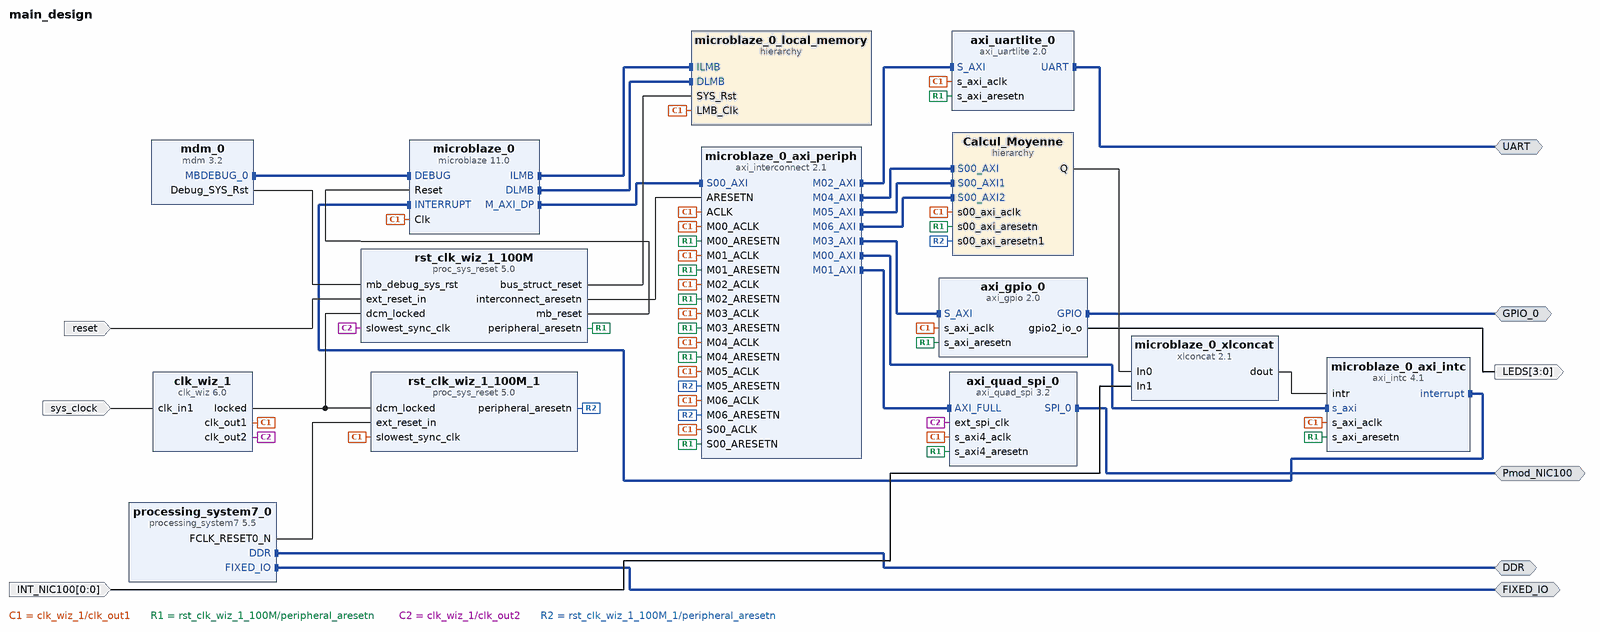
[diagram p0: block diagram of the top level]
# Vivado block design main_design, xc7z010clg400-1, Vivado 2020.2
create_bd_design main_design

create_bd_intf_port -mode Master -vlnv xilinx.com:interface:spi_rtl:1.0 Pmod_NIC100
create_bd_intf_port -mode Master -vlnv xilinx.com:interface:uart_rtl:1.0 UART
create_bd_intf_port -mode Master -vlnv xilinx.com:interface:gpio_rtl:1.0 GPIO_0
create_bd_intf_port -mode Master -vlnv xilinx.com:interface:ddrx_rtl:1.0 DDR
create_bd_intf_port -mode Master -vlnv xilinx.com:display_processing_system7:fixedio_rtl:1.0 FIXED_IO
create_bd_port -dir I -type rst reset
set_property -dict {CONFIG.POLARITY ACTIVE_HIGH} [get_bd_ports reset]
create_bd_port -dir I -type clk sys_clock
set_property -dict {CONFIG.FREQ_HZ 125000000} [get_bd_ports sys_clock]
create_bd_port -dir I -from 0 -to 0 INT_NIC100
create_bd_port -dir O -from 3 -to 0 LEDS

create_bd_cell -type ip -vlnv xilinx.com:ip:microblaze:11.0 microblaze_0
set_property -dict [list \
  CONFIG.C_ADDR_TAG_BITS 0 \
  CONFIG.C_DCACHE_ADDR_TAG 0 \
  CONFIG.C_DEBUG_ENABLED 1 \
  CONFIG.C_D_AXI 1 \
  CONFIG.C_D_LMB 1 \
  CONFIG.C_I_LMB 1 \
  CONFIG.C_NUMBER_OF_PC_BRK 4 \
  CONFIG.C_USE_BRANCH_TARGET_CACHE 1 \
  CONFIG.C_USE_DIV 1 \
  CONFIG.C_USE_FPU 2 \
  CONFIG.C_USE_HW_MUL 1 \
  CONFIG.C_USE_STACK_PROTECTION 1 \
] [get_bd_cells microblaze_0]
create_bd_cell -type ip -vlnv xilinx.com:ip:mdm:3.2 mdm_0
create_bd_cell -type hier microblaze_0_local_memory
create_bd_cell -type ip -vlnv xilinx.com:ip:axi_interconnect:2.1 microblaze_0_axi_periph
set_property -dict {CONFIG.NUM_MI 7} [get_bd_cells microblaze_0_axi_periph]
create_bd_cell -type ip -vlnv xilinx.com:ip:axi_intc:4.1 microblaze_0_axi_intc
set_property -dict [list \
  CONFIG.C_HAS_FAST 0 \
  CONFIG.C_KIND_OF_INTR 0xFFFFFFFD \
  CONFIG.C_KIND_OF_LVL 0xFFFFFFFD \
] [get_bd_cells microblaze_0_axi_intc]
create_bd_cell -type ip -vlnv xilinx.com:ip:xlconcat:2.1 microblaze_0_xlconcat
create_bd_cell -type hier Calcul_Moyenne
create_bd_cell -type ip -vlnv xilinx.com:ip:axi_gpio:2.0 axi_gpio_0
set_property -dict [list \
  CONFIG.C_ALL_INPUTS 0 \
  CONFIG.C_ALL_INPUTS_2 0 \
  CONFIG.C_GPIO2_WIDTH 4 \
  CONFIG.C_GPIO_WIDTH 4 \
  CONFIG.C_IS_DUAL 1 \
  CONFIG.GPIO2_BOARD_INTERFACE Custom \
  CONFIG.GPIO_BOARD_INTERFACE Custom \
  CONFIG.USE_BOARD_FLOW true \
] [get_bd_cells axi_gpio_0]
create_bd_cell -type ip -vlnv xilinx.com:ip:processing_system7:5.5 processing_system7_0
set_property -dict [list \
  CONFIG.PCW_APU_PERIPHERAL_FREQMHZ 667 \
  CONFIG.PCW_ENET0_ENET0_IO {MIO 16 .. 27} \
  CONFIG.PCW_ENET0_GRP_MDIO_ENABLE 1 \
  CONFIG.PCW_ENET0_GRP_MDIO_IO {MIO 52 .. 53} \
  CONFIG.PCW_ENET0_PERIPHERAL_ENABLE 1 \
  CONFIG.PCW_ENET0_RESET_ENABLE 0 \
  CONFIG.PCW_ENET_RESET_ENABLE 1 \
  CONFIG.PCW_ENET_RESET_SELECT {Share reset pin} \
  CONFIG.PCW_FPGA0_PERIPHERAL_FREQMHZ 50 \
  CONFIG.PCW_FPGA1_PERIPHERAL_FREQMHZ 50 \
  CONFIG.PCW_GPIO_MIO_GPIO_ENABLE 1 \
  CONFIG.PCW_GPIO_MIO_GPIO_IO MIO \
  CONFIG.PCW_I2C_RESET_ENABLE 1 \
  CONFIG.PCW_PERIPHERAL_BOARD_PRESET part0 \
  CONFIG.PCW_PRESET_BANK1_VOLTAGE {LVCMOS 1.8V} \
  CONFIG.PCW_QSPI_GRP_FBCLK_ENABLE 1 \
  CONFIG.PCW_QSPI_GRP_FBCLK_IO {MIO 8} \
  CONFIG.PCW_QSPI_GRP_SINGLE_SS_ENABLE 1 \
  CONFIG.PCW_QSPI_GRP_SINGLE_SS_IO {MIO 1 .. 6} \
  CONFIG.PCW_QSPI_PERIPHERAL_ENABLE 1 \
  CONFIG.PCW_QSPI_QSPI_IO {MIO 1 .. 6} \
  CONFIG.PCW_SD0_GRP_CD_ENABLE 1 \
  CONFIG.PCW_SD0_GRP_CD_IO {MIO 47} \
  CONFIG.PCW_SD0_GRP_WP_ENABLE 0 \
  CONFIG.PCW_SD0_PERIPHERAL_ENABLE 1 \
  CONFIG.PCW_SD0_SD0_IO {MIO 40 .. 45} \
  CONFIG.PCW_SDIO_PERIPHERAL_FREQMHZ 50 \
  CONFIG.PCW_SINGLE_QSPI_DATA_MODE x4 \
  CONFIG.PCW_UART1_PERIPHERAL_ENABLE 1 \
  CONFIG.PCW_UART1_UART1_IO {MIO 48 .. 49} \
  CONFIG.PCW_UART_PERIPHERAL_FREQMHZ 100 \
  CONFIG.PCW_UIPARAM_DDR_FREQ_MHZ 533.333333 \
  CONFIG.PCW_UIPARAM_DDR_MEMORY_TYPE {DDR 3 (Low Voltage)} \
  CONFIG.PCW_UIPARAM_DDR_PARTNO {MT41K256M16 RE-125} \
  CONFIG.PCW_USB0_PERIPHERAL_ENABLE 1 \
  CONFIG.PCW_USB0_RESET_ENABLE 1 \
  CONFIG.PCW_USB0_RESET_IO {MIO 46} \
  CONFIG.PCW_USB0_USB0_IO {MIO 28 .. 39} \
  CONFIG.PCW_USB_RESET_ENABLE 1 \
  CONFIG.PCW_USB_RESET_SELECT {Share reset pin} \
  CONFIG.PCW_USE_M_AXI_GP0 0 \
] [get_bd_cells processing_system7_0]
# 493 more settings of processing_system7_0 are not shown: defaults, MIO pin electricals, DDR timing, and values the tool derives
create_bd_cell -type ip -vlnv xilinx.com:ip:proc_sys_reset:5.0 rst_clk_wiz_1_100M
create_bd_cell -type ip -vlnv xilinx.com:ip:clk_wiz:6.0 clk_wiz_1
set_property -dict [list \
  CONFIG.CLKIN1_JITTER_PS 80.0 \
  CONFIG.CLKOUT1_JITTER 124.615 \
  CONFIG.CLKOUT1_PHASE_ERROR 96.948 \
  CONFIG.CLKOUT2_JITTER 172.798 \
  CONFIG.CLKOUT2_PHASE_ERROR 96.948 \
  CONFIG.CLKOUT2_REQUESTED_OUT_FREQ 20 \
  CONFIG.CLKOUT2_USED true \
  CONFIG.CLK_IN1_BOARD_INTERFACE Custom \
  CONFIG.MMCM_CLKFBOUT_MULT_F 8.000 \
  CONFIG.MMCM_CLKIN1_PERIOD 8.000 \
  CONFIG.MMCM_CLKOUT1_DIVIDE 50 \
  CONFIG.NUM_OUT_CLKS 2 \
  CONFIG.PRIM_IN_FREQ 125.000 \
  CONFIG.PRIM_SOURCE Single_ended_clock_capable_pin \
  CONFIG.USE_RESET false \
] [get_bd_cells clk_wiz_1]
create_bd_cell -type ip -vlnv xilinx.com:ip:axi_uartlite:2.0 axi_uartlite_0
set_property -dict {CONFIG.C_BAUDRATE 115200} [get_bd_cells axi_uartlite_0]
create_bd_cell -type ip -vlnv xilinx.com:ip:axi_quad_spi:3.2 axi_quad_spi_0
set_property -dict [list \
  CONFIG.C_FIFO_DEPTH 0 \
  CONFIG.C_SCK_RATIO 2 \
  CONFIG.C_TYPE_OF_AXI4_INTERFACE 1 \
  CONFIG.C_USE_STARTUP 0 \
  CONFIG.FIFO_INCLUDED 0 \
] [get_bd_cells axi_quad_spi_0]
create_bd_cell -type ip -vlnv xilinx.com:ip:proc_sys_reset:5.0 rst_clk_wiz_1_100M_1

# ---- hierarchy /microblaze_0_local_memory ----
current_bd_instance /microblaze_0_local_memory
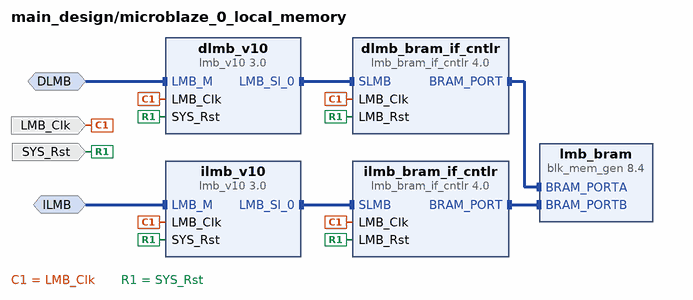
[diagram p1: block diagram inside /microblaze_0_local_memory]
create_bd_intf_pin -mode MirroredMaster -vlnv xilinx.com:interface:lmb_rtl:1.0 DLMB
create_bd_intf_pin -mode MirroredMaster -vlnv xilinx.com:interface:lmb_rtl:1.0 ILMB
create_bd_pin -dir I -type clk LMB_Clk
create_bd_pin -dir I -type rst SYS_Rst

create_bd_cell -type ip -vlnv xilinx.com:ip:lmb_v10:3.0 dlmb_v10
create_bd_cell -type ip -vlnv xilinx.com:ip:lmb_v10:3.0 ilmb_v10
create_bd_cell -type ip -vlnv xilinx.com:ip:lmb_bram_if_cntlr:4.0 dlmb_bram_if_cntlr
set_property -dict {CONFIG.C_ECC 0} [get_bd_cells dlmb_bram_if_cntlr]
create_bd_cell -type ip -vlnv xilinx.com:ip:lmb_bram_if_cntlr:4.0 ilmb_bram_if_cntlr
set_property -dict {CONFIG.C_ECC 0} [get_bd_cells ilmb_bram_if_cntlr]
create_bd_cell -type ip -vlnv xilinx.com:ip:blk_mem_gen:8.4 lmb_bram
set_property -dict {CONFIG.Memory_Type True_Dual_Port_RAM CONFIG.use_bram_block BRAM_Controller} [get_bd_cells lmb_bram]

# ---- hierarchy /Calcul_Moyenne ----
current_bd_instance /Calcul_Moyenne
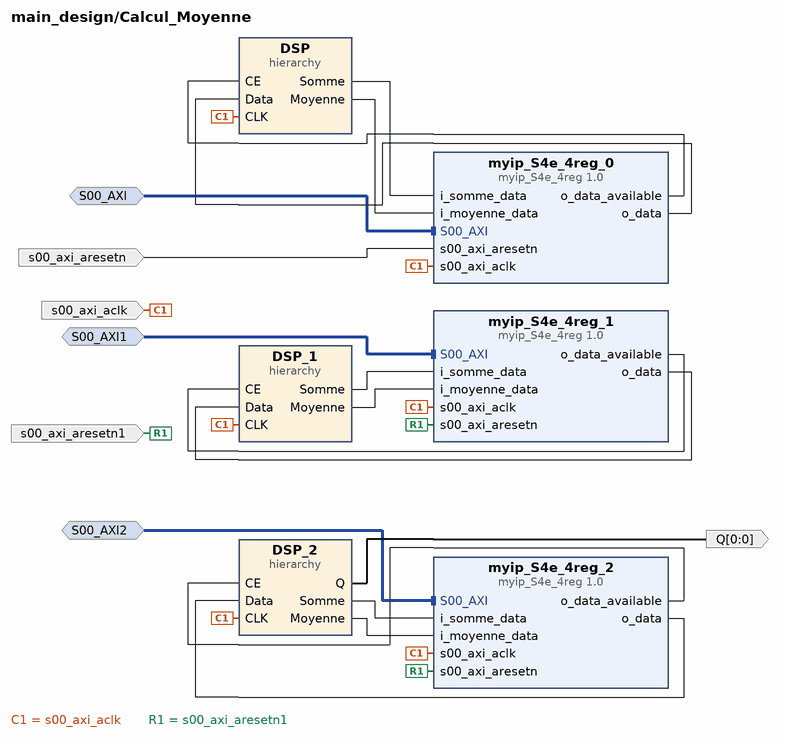
[diagram p2: block diagram inside /Calcul_Moyenne]
create_bd_intf_pin -mode Slave -vlnv xilinx.com:interface:aximm_rtl:1.0 S00_AXI
create_bd_intf_pin -mode Slave -vlnv xilinx.com:interface:aximm_rtl:1.0 S00_AXI1
create_bd_intf_pin -mode Slave -vlnv xilinx.com:interface:aximm_rtl:1.0 S00_AXI2
create_bd_pin -dir I -type clk s00_axi_aclk
create_bd_pin -dir I -type rst s00_axi_aresetn
create_bd_pin -dir O -from 0 -to 0 -type data Q
create_bd_pin -dir I -type rst s00_axi_aresetn1

create_bd_cell -type hier DSP_1
create_bd_cell -type ip -vlnv S4e:user:myip_S4e_4reg:1.0 myip_S4e_4reg_0
create_bd_cell -type ip -vlnv S4e:user:myip_S4e_4reg:1.0 myip_S4e_4reg_1
create_bd_cell -type ip -vlnv S4e:user:myip_S4e_4reg:1.0 myip_S4e_4reg_2
create_bd_cell -type hier DSP_2
create_bd_cell -type hier DSP

# ---- hierarchy /Calcul_Moyenne/DSP_1 ----
current_bd_instance /Calcul_Moyenne/DSP_1
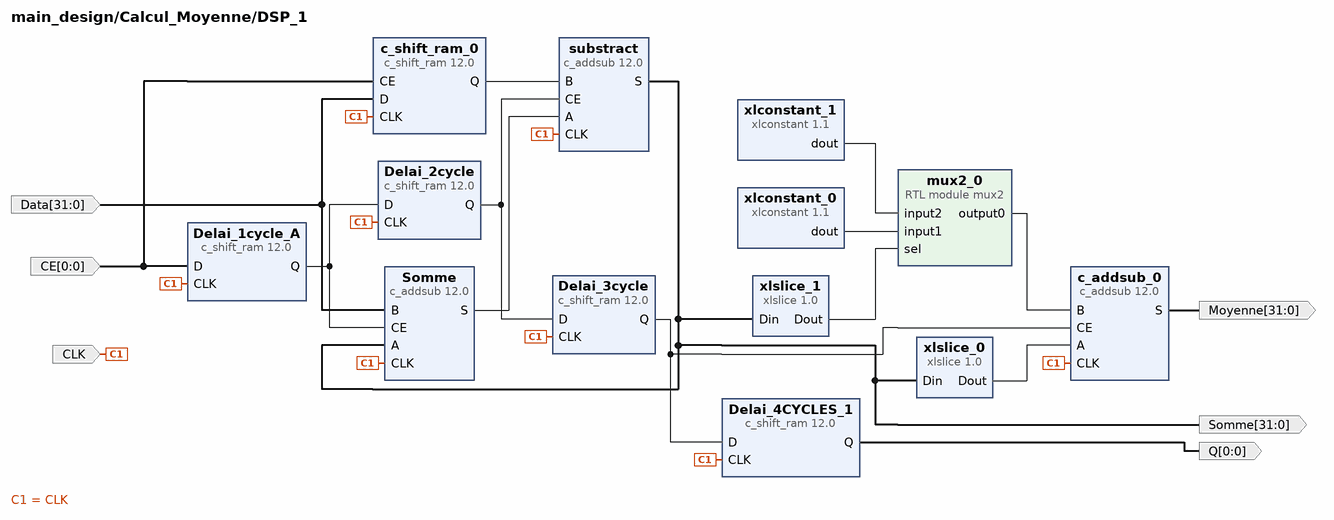
[diagram p3: block diagram inside /Calcul_Moyenne/DSP_1]
create_bd_pin -dir I -from 31 -to 0 Data
create_bd_pin -dir I -type clk CLK
create_bd_pin -dir I -from 0 -to 0 -type data CE
create_bd_pin -dir O -from 31 -to 0 -type data Somme
create_bd_pin -dir O -from 31 -to 0 Moyenne
create_bd_pin -dir O -from 0 -to 0 -type data Q

create_bd_cell -type ip -vlnv xilinx.com:ip:c_shift_ram:12.0 Delai_1cycle_A
set_property -dict {CONFIG.AsyncInitVal 0 CONFIG.DefaultData 0 CONFIG.Depth 1 CONFIG.Width 1} [get_bd_cells Delai_1cycle_A]
create_bd_cell -type ip -vlnv xilinx.com:ip:c_addsub:12.0 Somme
set_property -dict [list \
  CONFIG.A_Type Signed \
  CONFIG.A_Width 32 \
  CONFIG.Add_Mode Add \
  CONFIG.B_Type Signed \
  CONFIG.B_Value 00000000000000000000000000000000 \
  CONFIG.B_Width 32 \
  CONFIG.Latency 1 \
  CONFIG.Out_Width 32 \
] [get_bd_cells Somme]
create_bd_cell -type ip -vlnv xilinx.com:ip:c_shift_ram:12.0 c_shift_ram_0
set_property -dict [list \
  CONFIG.AsyncInitVal 00000000000000000000000000000000 \
  CONFIG.CE true \
  CONFIG.DefaultData 00000000000000000000000000000000 \
  CONFIG.Depth 9 \
  CONFIG.ReadMifFile false \
  CONFIG.SCLR false \
  CONFIG.ShiftRegType Fixed_Length \
  CONFIG.Width 32 \
] [get_bd_cells c_shift_ram_0]
create_bd_cell -type ip -vlnv xilinx.com:ip:c_addsub:12.0 substract
set_property -dict [list \
  CONFIG.A_Type Signed \
  CONFIG.A_Width 32 \
  CONFIG.Add_Mode Subtract \
  CONFIG.B_Type Signed \
  CONFIG.B_Value 00000000000000000000000000000000 \
  CONFIG.B_Width 32 \
  CONFIG.Implementation Fabric \
  CONFIG.Latency 1 \
  CONFIG.Latency_Configuration Manual \
  CONFIG.Out_Width 32 \
] [get_bd_cells substract]
create_bd_cell -type ip -vlnv xilinx.com:ip:c_shift_ram:12.0 Delai_3cycle
set_property -dict {CONFIG.AsyncInitVal 0 CONFIG.DefaultData 0 CONFIG.Depth 1 CONFIG.Width 1} [get_bd_cells Delai_3cycle]
create_bd_cell -type ip -vlnv xilinx.com:ip:xlslice:1.0 xlslice_0
set_property -dict {CONFIG.DIN_FROM 31 CONFIG.DIN_TO 3 CONFIG.DOUT_WIDTH 29} [get_bd_cells xlslice_0]
create_bd_cell -type ip -vlnv xilinx.com:ip:c_shift_ram:12.0 Delai_2cycle
set_property -dict {CONFIG.AsyncInitVal 0 CONFIG.DefaultData 0 CONFIG.Depth 2 CONFIG.Width 1} [get_bd_cells Delai_2cycle]
create_bd_cell -type ip -vlnv xilinx.com:ip:c_addsub:12.0 c_addsub_0
set_property -dict [list \
  CONFIG.A_Type Signed \
  CONFIG.A_Width 32 \
  CONFIG.B_Constant false \
  CONFIG.B_Type Signed \
  CONFIG.B_Value 00000000000000000000000000000000 \
  CONFIG.B_Width 32 \
  CONFIG.Latency 1 \
  CONFIG.Out_Width 32 \
] [get_bd_cells c_addsub_0]
create_bd_cell -type ip -vlnv xilinx.com:ip:c_shift_ram:12.0 Delai_4CYCLES_1
set_property -dict {CONFIG.AsyncInitVal 0 CONFIG.DefaultData 0 CONFIG.Depth 1 CONFIG.Width 1} [get_bd_cells Delai_4CYCLES_1]
create_bd_cell -type ip -vlnv xilinx.com:ip:xlslice:1.0 xlslice_1
set_property -dict {CONFIG.DIN_FROM 31 CONFIG.DIN_TO 31 CONFIG.DOUT_WIDTH 1} [get_bd_cells xlslice_1]
create_bd_cell -type ip -vlnv xilinx.com:ip:xlconstant:1.1 xlconstant_0
set_property -dict {CONFIG.CONST_VAL 0 CONFIG.CONST_WIDTH 32} [get_bd_cells xlconstant_0]
create_bd_cell -type ip -vlnv xilinx.com:ip:xlconstant:1.1 xlconstant_1
set_property -dict {CONFIG.CONST_VAL 0xE0000000 CONFIG.CONST_WIDTH 32} [get_bd_cells xlconstant_1]
create_bd_cell -type module -reference mux2 mux2_0

# ---- hierarchy /Calcul_Moyenne/DSP_2 ----
current_bd_instance /Calcul_Moyenne/DSP_2
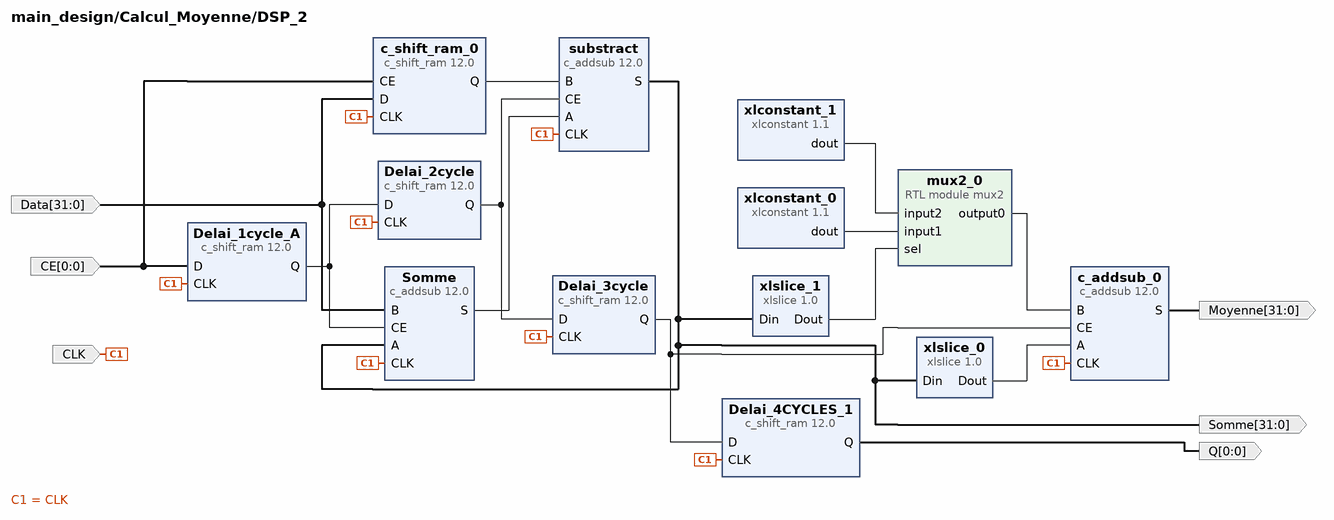
[diagram p4: block diagram inside /Calcul_Moyenne/DSP_2]
create_bd_pin -dir I -from 31 -to 0 Data
create_bd_pin -dir I -type clk CLK
create_bd_pin -dir I -from 0 -to 0 -type data CE
create_bd_pin -dir O -from 31 -to 0 -type data Somme
create_bd_pin -dir O -from 31 -to 0 Moyenne
create_bd_pin -dir O -from 0 -to 0 -type data Q

create_bd_cell -type ip -vlnv xilinx.com:ip:c_shift_ram:12.0 Delai_1cycle_A
set_property -dict {CONFIG.AsyncInitVal 0 CONFIG.DefaultData 0 CONFIG.Depth 1 CONFIG.Width 1} [get_bd_cells Delai_1cycle_A]
create_bd_cell -type ip -vlnv xilinx.com:ip:c_addsub:12.0 Somme
set_property -dict [list \
  CONFIG.A_Type Signed \
  CONFIG.A_Width 32 \
  CONFIG.Add_Mode Add \
  CONFIG.B_Type Signed \
  CONFIG.B_Value 00000000000000000000000000000000 \
  CONFIG.B_Width 32 \
  CONFIG.Latency 1 \
  CONFIG.Out_Width 32 \
] [get_bd_cells Somme]
create_bd_cell -type ip -vlnv xilinx.com:ip:c_shift_ram:12.0 c_shift_ram_0
set_property -dict [list \
  CONFIG.AsyncInitVal 00000000000000000000000000000000 \
  CONFIG.CE true \
  CONFIG.DefaultData 00000000000000000000000000000000 \
  CONFIG.Depth 9 \
  CONFIG.ReadMifFile false \
  CONFIG.SCLR false \
  CONFIG.ShiftRegType Fixed_Length \
  CONFIG.Width 32 \
] [get_bd_cells c_shift_ram_0]
create_bd_cell -type ip -vlnv xilinx.com:ip:c_addsub:12.0 substract
set_property -dict [list \
  CONFIG.A_Type Signed \
  CONFIG.A_Width 32 \
  CONFIG.Add_Mode Subtract \
  CONFIG.B_Type Signed \
  CONFIG.B_Value 00000000000000000000000000000000 \
  CONFIG.B_Width 32 \
  CONFIG.Implementation Fabric \
  CONFIG.Latency 1 \
  CONFIG.Latency_Configuration Manual \
  CONFIG.Out_Width 32 \
] [get_bd_cells substract]
create_bd_cell -type ip -vlnv xilinx.com:ip:c_shift_ram:12.0 Delai_3cycle
set_property -dict {CONFIG.AsyncInitVal 0 CONFIG.DefaultData 0 CONFIG.Depth 1 CONFIG.Width 1} [get_bd_cells Delai_3cycle]
create_bd_cell -type ip -vlnv xilinx.com:ip:xlslice:1.0 xlslice_0
set_property -dict {CONFIG.DIN_FROM 31 CONFIG.DIN_TO 3 CONFIG.DOUT_WIDTH 29} [get_bd_cells xlslice_0]
create_bd_cell -type ip -vlnv xilinx.com:ip:c_shift_ram:12.0 Delai_2cycle
set_property -dict {CONFIG.AsyncInitVal 0 CONFIG.DefaultData 0 CONFIG.Depth 2 CONFIG.Width 1} [get_bd_cells Delai_2cycle]
create_bd_cell -type ip -vlnv xilinx.com:ip:c_addsub:12.0 c_addsub_0
set_property -dict [list \
  CONFIG.A_Type Signed \
  CONFIG.A_Width 32 \
  CONFIG.B_Constant false \
  CONFIG.B_Type Signed \
  CONFIG.B_Value 00000000000000000000000000000000 \
  CONFIG.B_Width 32 \
  CONFIG.Latency 1 \
  CONFIG.Out_Width 32 \
] [get_bd_cells c_addsub_0]
create_bd_cell -type ip -vlnv xilinx.com:ip:c_shift_ram:12.0 Delai_4CYCLES_1
set_property -dict {CONFIG.AsyncInitVal 0 CONFIG.DefaultData 0 CONFIG.Depth 1 CONFIG.Width 1} [get_bd_cells Delai_4CYCLES_1]
create_bd_cell -type ip -vlnv xilinx.com:ip:xlslice:1.0 xlslice_1
set_property -dict {CONFIG.DIN_FROM 31 CONFIG.DIN_TO 31 CONFIG.DOUT_WIDTH 1} [get_bd_cells xlslice_1]
create_bd_cell -type ip -vlnv xilinx.com:ip:xlconstant:1.1 xlconstant_0
set_property -dict {CONFIG.CONST_VAL 0 CONFIG.CONST_WIDTH 32} [get_bd_cells xlconstant_0]
create_bd_cell -type ip -vlnv xilinx.com:ip:xlconstant:1.1 xlconstant_1
set_property -dict {CONFIG.CONST_VAL 0xE0000000 CONFIG.CONST_WIDTH 32} [get_bd_cells xlconstant_1]
create_bd_cell -type module -reference mux2 mux2_0

# ---- hierarchy /Calcul_Moyenne/DSP ----
current_bd_instance /Calcul_Moyenne/DSP
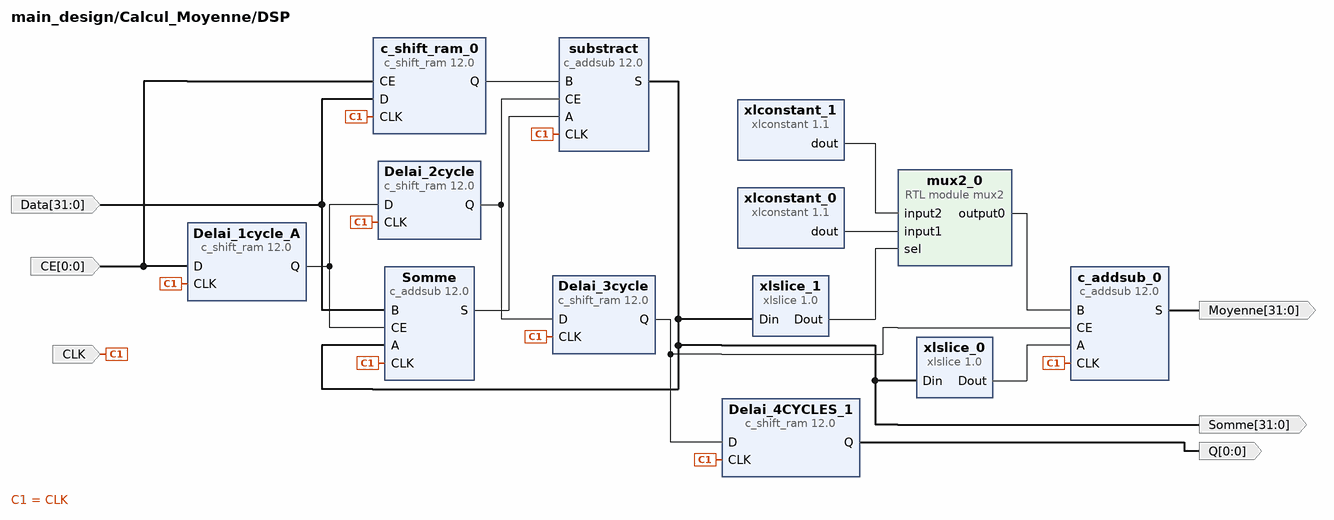
[diagram p5: block diagram inside /Calcul_Moyenne/DSP]
create_bd_pin -dir I -from 31 -to 0 Data
create_bd_pin -dir I -type clk CLK
create_bd_pin -dir I -from 0 -to 0 -type data CE
create_bd_pin -dir O -from 31 -to 0 -type data Somme
create_bd_pin -dir O -from 31 -to 0 Moyenne
create_bd_pin -dir O -from 0 -to 0 -type data Q

create_bd_cell -type ip -vlnv xilinx.com:ip:c_shift_ram:12.0 Delai_1cycle_A
set_property -dict {CONFIG.AsyncInitVal 0 CONFIG.DefaultData 0 CONFIG.Depth 1 CONFIG.Width 1} [get_bd_cells Delai_1cycle_A]
create_bd_cell -type ip -vlnv xilinx.com:ip:c_addsub:12.0 Somme
set_property -dict [list \
  CONFIG.A_Type Signed \
  CONFIG.A_Width 32 \
  CONFIG.Add_Mode Add \
  CONFIG.B_Type Signed \
  CONFIG.B_Value 00000000000000000000000000000000 \
  CONFIG.B_Width 32 \
  CONFIG.Latency 1 \
  CONFIG.Out_Width 32 \
] [get_bd_cells Somme]
create_bd_cell -type ip -vlnv xilinx.com:ip:c_shift_ram:12.0 c_shift_ram_0
set_property -dict [list \
  CONFIG.AsyncInitVal 00000000000000000000000000000000 \
  CONFIG.CE true \
  CONFIG.DefaultData 00000000000000000000000000000000 \
  CONFIG.Depth 9 \
  CONFIG.ReadMifFile false \
  CONFIG.SCLR false \
  CONFIG.ShiftRegType Fixed_Length \
  CONFIG.Width 32 \
] [get_bd_cells c_shift_ram_0]
create_bd_cell -type ip -vlnv xilinx.com:ip:c_addsub:12.0 substract
set_property -dict [list \
  CONFIG.A_Type Signed \
  CONFIG.A_Width 32 \
  CONFIG.Add_Mode Subtract \
  CONFIG.B_Type Signed \
  CONFIG.B_Value 00000000000000000000000000000000 \
  CONFIG.B_Width 32 \
  CONFIG.Implementation Fabric \
  CONFIG.Latency 1 \
  CONFIG.Latency_Configuration Manual \
  CONFIG.Out_Width 32 \
] [get_bd_cells substract]
create_bd_cell -type ip -vlnv xilinx.com:ip:c_shift_ram:12.0 Delai_3cycle
set_property -dict {CONFIG.AsyncInitVal 0 CONFIG.DefaultData 0 CONFIG.Depth 1 CONFIG.Width 1} [get_bd_cells Delai_3cycle]
create_bd_cell -type ip -vlnv xilinx.com:ip:xlslice:1.0 xlslice_0
set_property -dict {CONFIG.DIN_FROM 31 CONFIG.DIN_TO 3 CONFIG.DOUT_WIDTH 29} [get_bd_cells xlslice_0]
create_bd_cell -type ip -vlnv xilinx.com:ip:c_shift_ram:12.0 Delai_2cycle
set_property -dict {CONFIG.AsyncInitVal 0 CONFIG.DefaultData 0 CONFIG.Depth 2 CONFIG.Width 1} [get_bd_cells Delai_2cycle]
create_bd_cell -type ip -vlnv xilinx.com:ip:c_addsub:12.0 c_addsub_0
set_property -dict [list \
  CONFIG.A_Type Signed \
  CONFIG.A_Width 32 \
  CONFIG.B_Constant false \
  CONFIG.B_Type Signed \
  CONFIG.B_Value 00000000000000000000000000000000 \
  CONFIG.B_Width 32 \
  CONFIG.Latency 1 \
  CONFIG.Out_Width 32 \
] [get_bd_cells c_addsub_0]
create_bd_cell -type ip -vlnv xilinx.com:ip:c_shift_ram:12.0 Delai_4CYCLES_1
set_property -dict {CONFIG.AsyncInitVal 0 CONFIG.DefaultData 0 CONFIG.Depth 1 CONFIG.Width 1} [get_bd_cells Delai_4CYCLES_1]
create_bd_cell -type ip -vlnv xilinx.com:ip:xlslice:1.0 xlslice_1
set_property -dict {CONFIG.DIN_FROM 31 CONFIG.DIN_TO 31 CONFIG.DOUT_WIDTH 1} [get_bd_cells xlslice_1]
create_bd_cell -type ip -vlnv xilinx.com:ip:xlconstant:1.1 xlconstant_0
set_property -dict {CONFIG.CONST_VAL 0 CONFIG.CONST_WIDTH 32} [get_bd_cells xlconstant_0]
create_bd_cell -type ip -vlnv xilinx.com:ip:xlconstant:1.1 xlconstant_1
set_property -dict {CONFIG.CONST_VAL 0xE0000000 CONFIG.CONST_WIDTH 32} [get_bd_cells xlconstant_1]
create_bd_cell -type module -reference mux2 mux2_0

# ---- connections ----

current_bd_instance /microblaze_0_local_memory
connect_bd_intf_net -intf_net microblaze_0_ilmb_bus [get_bd_intf_pins ilmb_v10/LMB_Sl_0] [get_bd_intf_pins ilmb_bram_if_cntlr/SLMB]
connect_bd_intf_net -intf_net microblaze_0_ilmb_cntlr [get_bd_intf_pins ilmb_bram_if_cntlr/BRAM_PORT] [get_bd_intf_pins lmb_bram/BRAM_PORTB]
connect_bd_intf_net -intf_net microblaze_0_dlmb [get_bd_intf_pins DLMB] [get_bd_intf_pins dlmb_v10/LMB_M]
connect_bd_intf_net -intf_net microblaze_0_dlmb_bus [get_bd_intf_pins dlmb_v10/LMB_Sl_0] [get_bd_intf_pins dlmb_bram_if_cntlr/SLMB]
connect_bd_intf_net -intf_net microblaze_0_dlmb_cntlr [get_bd_intf_pins dlmb_bram_if_cntlr/BRAM_PORT] [get_bd_intf_pins lmb_bram/BRAM_PORTA]
connect_bd_intf_net -intf_net microblaze_0_ilmb [get_bd_intf_pins ILMB] [get_bd_intf_pins ilmb_v10/LMB_M]
connect_bd_net -net microblaze_0_Clk [get_bd_pins LMB_Clk] \
  [get_bd_pins dlmb_v10/LMB_Clk] [get_bd_pins dlmb_bram_if_cntlr/LMB_Clk] [get_bd_pins ilmb_v10/LMB_Clk] \
  [get_bd_pins ilmb_bram_if_cntlr/LMB_Clk]
connect_bd_net [get_bd_pins SYS_Rst] \
  [get_bd_pins dlmb_v10/SYS_Rst] [get_bd_pins dlmb_bram_if_cntlr/LMB_Rst] [get_bd_pins ilmb_v10/SYS_Rst] \
  [get_bd_pins ilmb_bram_if_cntlr/LMB_Rst]
set_property HDL_ATTRIBUTE.BMM_INFO_ADDRESS_SPACE {byte  0x00000000 32 > main_design microblaze_0_local_memory/lmb_bram} [get_bd_cells dlmb_bram_if_cntlr]
set_property HDL_ATTRIBUTE.KEEP_HIERARCHY yes [get_bd_cells dlmb_bram_if_cntlr]

current_bd_instance /Calcul_Moyenne
connect_bd_intf_net -intf_net S00_AXI1_1 [get_bd_intf_pins S00_AXI1] [get_bd_intf_pins myip_S4e_4reg_1/S00_AXI]
connect_bd_intf_net -intf_net S00_AXI2_1 [get_bd_intf_pins S00_AXI2] [get_bd_intf_pins myip_S4e_4reg_2/S00_AXI]
connect_bd_intf_net [get_bd_intf_pins S00_AXI] [get_bd_intf_pins myip_S4e_4reg_0/S00_AXI]
connect_bd_net [get_bd_pins s00_axi_aclk] \
  [get_bd_pins DSP_1/CLK] [get_bd_pins myip_S4e_4reg_0/s00_axi_aclk] [get_bd_pins myip_S4e_4reg_1/s00_axi_aclk] \
  [get_bd_pins myip_S4e_4reg_2/s00_axi_aclk] [get_bd_pins DSP_2/CLK] [get_bd_pins DSP/CLK]
connect_bd_net [get_bd_pins s00_axi_aresetn] [get_bd_pins myip_S4e_4reg_0/s00_axi_aresetn]
connect_bd_net [get_bd_pins myip_S4e_4reg_1/o_data_available] [get_bd_pins DSP_1/CE]
connect_bd_net [get_bd_pins myip_S4e_4reg_1/o_data] [get_bd_pins DSP_1/Data]
connect_bd_net [get_bd_pins DSP_1/Somme] [get_bd_pins myip_S4e_4reg_1/i_somme_data]
connect_bd_net [get_bd_pins DSP_1/Moyenne] [get_bd_pins myip_S4e_4reg_1/i_moyenne_data]
connect_bd_net -net s00_axi_aresetn1_1 [get_bd_pins s00_axi_aresetn1] \
  [get_bd_pins myip_S4e_4reg_1/s00_axi_aresetn] [get_bd_pins myip_S4e_4reg_2/s00_axi_aresetn]
connect_bd_net [get_bd_pins DSP_2/Q] [get_bd_pins Q]
connect_bd_net [get_bd_pins myip_S4e_4reg_2/o_data_available] [get_bd_pins DSP_2/CE]
connect_bd_net [get_bd_pins myip_S4e_4reg_0/o_data_available] [get_bd_pins DSP/CE]
connect_bd_net [get_bd_pins myip_S4e_4reg_0/o_data] [get_bd_pins DSP/Data]
connect_bd_net [get_bd_pins myip_S4e_4reg_2/o_data] [get_bd_pins DSP_2/Data]
connect_bd_net [get_bd_pins DSP/Somme] [get_bd_pins myip_S4e_4reg_0/i_somme_data]
connect_bd_net [get_bd_pins DSP/Moyenne] [get_bd_pins myip_S4e_4reg_0/i_moyenne_data]
connect_bd_net [get_bd_pins DSP_2/Somme] [get_bd_pins myip_S4e_4reg_2/i_somme_data]
connect_bd_net [get_bd_pins DSP_2/Moyenne] [get_bd_pins myip_S4e_4reg_2/i_moyenne_data]

current_bd_instance /Calcul_Moyenne/DSP_1
connect_bd_net -net D_0_1 [get_bd_pins CE] [get_bd_pins Delai_1cycle_A/D] [get_bd_pins c_shift_ram_0/CE]
connect_bd_net [get_bd_pins Somme/S] [get_bd_pins substract/A]
connect_bd_net [get_bd_pins Delai_1cycle_A/Q] [get_bd_pins Somme/CE] [get_bd_pins Delai_2cycle/D]
connect_bd_net [get_bd_pins Delai_2cycle/Q] [get_bd_pins substract/CE] [get_bd_pins Delai_3cycle/D]
connect_bd_net [get_bd_pins Data] [get_bd_pins Somme/B] [get_bd_pins c_shift_ram_0/D]
connect_bd_net [get_bd_pins substract/S] [get_bd_pins Somme] [get_bd_pins Somme/A] [get_bd_pins xlslice_0/Din] [get_bd_pins xlslice_1/Din]
connect_bd_net [get_bd_pins c_shift_ram_0/Q] [get_bd_pins substract/B]
connect_bd_net [get_bd_pins CLK] \
  [get_bd_pins c_shift_ram_0/CLK] [get_bd_pins Delai_1cycle_A/CLK] [get_bd_pins Delai_2cycle/CLK] [get_bd_pins substract/CLK] \
  [get_bd_pins Somme/CLK] [get_bd_pins Delai_3cycle/CLK] [get_bd_pins Delai_4CYCLES_1/CLK] [get_bd_pins c_addsub_0/CLK]
connect_bd_net -net Delai_4CYCLES_Q [get_bd_pins Delai_3cycle/Q] [get_bd_pins Delai_4CYCLES_1/D] [get_bd_pins c_addsub_0/CE]
connect_bd_net [get_bd_pins Delai_4CYCLES_1/Q] [get_bd_pins Q]
connect_bd_net [get_bd_pins xlslice_0/Dout] [get_bd_pins c_addsub_0/A]
connect_bd_net [get_bd_pins c_addsub_0/S] [get_bd_pins Moyenne]
connect_bd_net [get_bd_pins xlslice_1/Dout] [get_bd_pins mux2_0/sel]
connect_bd_net [get_bd_pins xlconstant_1/dout] [get_bd_pins mux2_0/input2]
connect_bd_net [get_bd_pins xlconstant_0/dout] [get_bd_pins mux2_0/input1]
connect_bd_net [get_bd_pins mux2_0/output0] [get_bd_pins c_addsub_0/B]

current_bd_instance /Calcul_Moyenne/DSP_2
connect_bd_net -net D_0_1 [get_bd_pins CE] [get_bd_pins Delai_1cycle_A/D] [get_bd_pins c_shift_ram_0/CE]
connect_bd_net [get_bd_pins Somme/S] [get_bd_pins substract/A]
connect_bd_net [get_bd_pins Delai_1cycle_A/Q] [get_bd_pins Somme/CE] [get_bd_pins Delai_2cycle/D]
connect_bd_net [get_bd_pins Delai_2cycle/Q] [get_bd_pins substract/CE] [get_bd_pins Delai_3cycle/D]
connect_bd_net [get_bd_pins Data] [get_bd_pins Somme/B] [get_bd_pins c_shift_ram_0/D]
connect_bd_net [get_bd_pins substract/S] [get_bd_pins Somme] [get_bd_pins Somme/A] [get_bd_pins xlslice_0/Din] [get_bd_pins xlslice_1/Din]
connect_bd_net [get_bd_pins c_shift_ram_0/Q] [get_bd_pins substract/B]
connect_bd_net [get_bd_pins CLK] \
  [get_bd_pins c_shift_ram_0/CLK] [get_bd_pins Delai_1cycle_A/CLK] [get_bd_pins Delai_2cycle/CLK] [get_bd_pins substract/CLK] \
  [get_bd_pins Somme/CLK] [get_bd_pins Delai_3cycle/CLK] [get_bd_pins Delai_4CYCLES_1/CLK] [get_bd_pins c_addsub_0/CLK]
connect_bd_net -net Delai_4CYCLES_Q [get_bd_pins Delai_3cycle/Q] [get_bd_pins Delai_4CYCLES_1/D] [get_bd_pins c_addsub_0/CE]
connect_bd_net [get_bd_pins Delai_4CYCLES_1/Q] [get_bd_pins Q]
connect_bd_net [get_bd_pins xlslice_0/Dout] [get_bd_pins c_addsub_0/A]
connect_bd_net [get_bd_pins c_addsub_0/S] [get_bd_pins Moyenne]
connect_bd_net [get_bd_pins xlslice_1/Dout] [get_bd_pins mux2_0/sel]
connect_bd_net [get_bd_pins xlconstant_1/dout] [get_bd_pins mux2_0/input2]
connect_bd_net [get_bd_pins xlconstant_0/dout] [get_bd_pins mux2_0/input1]
connect_bd_net [get_bd_pins mux2_0/output0] [get_bd_pins c_addsub_0/B]

current_bd_instance /Calcul_Moyenne/DSP
connect_bd_net -net D_0_1 [get_bd_pins CE] [get_bd_pins Delai_1cycle_A/D] [get_bd_pins c_shift_ram_0/CE]
connect_bd_net [get_bd_pins Somme/S] [get_bd_pins substract/A]
connect_bd_net [get_bd_pins Delai_1cycle_A/Q] [get_bd_pins Somme/CE] [get_bd_pins Delai_2cycle/D]
connect_bd_net [get_bd_pins Delai_2cycle/Q] [get_bd_pins substract/CE] [get_bd_pins Delai_3cycle/D]
connect_bd_net [get_bd_pins Data] [get_bd_pins Somme/B] [get_bd_pins c_shift_ram_0/D]
connect_bd_net [get_bd_pins substract/S] [get_bd_pins Somme] [get_bd_pins Somme/A] [get_bd_pins xlslice_0/Din] [get_bd_pins xlslice_1/Din]
connect_bd_net [get_bd_pins c_shift_ram_0/Q] [get_bd_pins substract/B]
connect_bd_net [get_bd_pins CLK] \
  [get_bd_pins c_shift_ram_0/CLK] [get_bd_pins Delai_1cycle_A/CLK] [get_bd_pins Delai_2cycle/CLK] [get_bd_pins substract/CLK] \
  [get_bd_pins Somme/CLK] [get_bd_pins Delai_3cycle/CLK] [get_bd_pins Delai_4CYCLES_1/CLK] [get_bd_pins c_addsub_0/CLK]
connect_bd_net -net Delai_4CYCLES_Q [get_bd_pins Delai_3cycle/Q] [get_bd_pins Delai_4CYCLES_1/D] [get_bd_pins c_addsub_0/CE]
connect_bd_net [get_bd_pins Delai_4CYCLES_1/Q] [get_bd_pins Q]
connect_bd_net [get_bd_pins xlslice_0/Dout] [get_bd_pins c_addsub_0/A]
connect_bd_net [get_bd_pins xlslice_1/Dout] [get_bd_pins mux2_0/sel]
connect_bd_net [get_bd_pins xlconstant_1/dout] [get_bd_pins mux2_0/input2]
connect_bd_net [get_bd_pins xlconstant_0/dout] [get_bd_pins mux2_0/input1]
connect_bd_net [get_bd_pins mux2_0/output0] [get_bd_pins c_addsub_0/B]
connect_bd_net [get_bd_pins c_addsub_0/S] [get_bd_pins Moyenne]

current_bd_instance /
connect_bd_intf_net [get_bd_intf_ports DDR] [get_bd_intf_pins processing_system7_0/DDR]
connect_bd_intf_net -intf_net microblaze_0_axi_dp [get_bd_intf_pins microblaze_0_axi_periph/S00_AXI] [get_bd_intf_pins microblaze_0/M_AXI_DP]
connect_bd_intf_net [get_bd_intf_ports GPIO_0] [get_bd_intf_pins axi_gpio_0/GPIO]
connect_bd_intf_net [get_bd_intf_pins microblaze_0_axi_intc/interrupt] [get_bd_intf_pins microblaze_0/INTERRUPT]
connect_bd_intf_net [get_bd_intf_ports UART] [get_bd_intf_pins axi_uartlite_0/UART]
connect_bd_intf_net [get_bd_intf_pins mdm_0/MBDEBUG_0] [get_bd_intf_pins microblaze_0/DEBUG]
connect_bd_intf_net [get_bd_intf_pins microblaze_0_axi_periph/M04_AXI] [get_bd_intf_pins Calcul_Moyenne/S00_AXI]
connect_bd_intf_net -intf_net microblaze_0_intc_axi [get_bd_intf_pins microblaze_0_axi_periph/M00_AXI] [get_bd_intf_pins microblaze_0_axi_intc/s_axi]
connect_bd_intf_net [get_bd_intf_ports FIXED_IO] [get_bd_intf_pins processing_system7_0/FIXED_IO]
connect_bd_intf_net [get_bd_intf_pins microblaze_0/ILMB] [get_bd_intf_pins microblaze_0_local_memory/ILMB]
connect_bd_intf_net [get_bd_intf_pins microblaze_0_axi_periph/M03_AXI] [get_bd_intf_pins axi_gpio_0/S_AXI]
connect_bd_intf_net [get_bd_intf_pins microblaze_0_axi_periph/M02_AXI] [get_bd_intf_pins axi_uartlite_0/S_AXI]
connect_bd_intf_net [get_bd_intf_ports Pmod_NIC100] [get_bd_intf_pins axi_quad_spi_0/SPI_0]
connect_bd_intf_net [get_bd_intf_pins microblaze_0_axi_periph/M01_AXI] [get_bd_intf_pins axi_quad_spi_0/AXI_FULL]
connect_bd_intf_net [get_bd_intf_pins microblaze_0_axi_periph/M05_AXI] [get_bd_intf_pins Calcul_Moyenne/S00_AXI1]
connect_bd_intf_net [get_bd_intf_pins microblaze_0/DLMB] [get_bd_intf_pins microblaze_0_local_memory/DLMB]
connect_bd_intf_net [get_bd_intf_pins microblaze_0_axi_periph/M06_AXI] [get_bd_intf_pins Calcul_Moyenne/S00_AXI2]
connect_bd_net -net microblaze_0_intr [get_bd_pins microblaze_0_xlconcat/dout] [get_bd_pins microblaze_0_axi_intc/intr]
connect_bd_net -net microblaze_0_Clk [get_bd_pins clk_wiz_1/clk_out1] \
  [get_bd_pins microblaze_0/Clk] [get_bd_pins microblaze_0_axi_periph/ACLK] [get_bd_pins microblaze_0_axi_periph/S00_ACLK] \
  [get_bd_pins microblaze_0_axi_periph/M00_ACLK] [get_bd_pins microblaze_0_axi_intc/s_axi_aclk] \
  [get_bd_pins microblaze_0_local_memory/LMB_Clk] [get_bd_pins microblaze_0_axi_periph/M01_ACLK] \
  [get_bd_pins microblaze_0_axi_periph/M02_ACLK] [get_bd_pins microblaze_0_axi_periph/M03_ACLK] \
  [get_bd_pins microblaze_0_axi_periph/M04_ACLK] [get_bd_pins Calcul_Moyenne/s00_axi_aclk] \
  [get_bd_pins axi_gpio_0/s_axi_aclk] [get_bd_pins axi_uartlite_0/s_axi_aclk] [get_bd_pins axi_quad_spi_0/s_axi4_aclk] \
  [get_bd_pins microblaze_0_axi_periph/M05_ACLK] [get_bd_pins rst_clk_wiz_1_100M_1/slowest_sync_clk] \
  [get_bd_pins microblaze_0_axi_periph/M06_ACLK]
connect_bd_net [get_bd_pins clk_wiz_1/locked] [get_bd_pins rst_clk_wiz_1_100M/dcm_locked] [get_bd_pins rst_clk_wiz_1_100M_1/dcm_locked]
connect_bd_net [get_bd_pins rst_clk_wiz_1_100M/mb_reset] [get_bd_pins microblaze_0/Reset]
connect_bd_net [get_bd_pins rst_clk_wiz_1_100M/bus_struct_reset] [get_bd_pins microblaze_0_local_memory/SYS_Rst]
connect_bd_net [get_bd_pins rst_clk_wiz_1_100M/peripheral_aresetn] \
  [get_bd_pins microblaze_0_axi_periph/S00_ARESETN] [get_bd_pins microblaze_0_axi_periph/M00_ARESETN] \
  [get_bd_pins microblaze_0_axi_intc/s_axi_aresetn] [get_bd_pins microblaze_0_axi_periph/M01_ARESETN] \
  [get_bd_pins microblaze_0_axi_periph/M02_ARESETN] [get_bd_pins microblaze_0_axi_periph/M03_ARESETN] \
  [get_bd_pins microblaze_0_axi_periph/M04_ARESETN] [get_bd_pins Calcul_Moyenne/s00_axi_aresetn] \
  [get_bd_pins axi_gpio_0/s_axi_aresetn] [get_bd_pins axi_uartlite_0/s_axi_aresetn] \
  [get_bd_pins axi_quad_spi_0/s_axi4_aresetn]
connect_bd_net -net mdm_1_debug_sys_rst [get_bd_pins mdm_0/Debug_SYS_Rst] [get_bd_pins rst_clk_wiz_1_100M/mb_debug_sys_rst]
connect_bd_net -net ext_reset_in_0_1 [get_bd_ports reset] [get_bd_pins rst_clk_wiz_1_100M/ext_reset_in]
connect_bd_net -net clk_in1_0_1 [get_bd_ports sys_clock] [get_bd_pins clk_wiz_1/clk_in1]
connect_bd_net [get_bd_pins clk_wiz_1/clk_out2] [get_bd_pins rst_clk_wiz_1_100M/slowest_sync_clk] [get_bd_pins axi_quad_spi_0/ext_spi_clk]
connect_bd_net -net In1_0_1 [get_bd_ports INT_NIC100] [get_bd_pins microblaze_0_xlconcat/In1]
connect_bd_net [get_bd_pins axi_gpio_0/gpio2_io_o] [get_bd_ports LEDS]
connect_bd_net -net ARESETN_1 [get_bd_pins rst_clk_wiz_1_100M/interconnect_aresetn] [get_bd_pins microblaze_0_axi_periph/ARESETN]
connect_bd_net [get_bd_pins Calcul_Moyenne/Q] [get_bd_pins microblaze_0_xlconcat/In0]
connect_bd_net [get_bd_pins rst_clk_wiz_1_100M_1/peripheral_aresetn] \
  [get_bd_pins Calcul_Moyenne/s00_axi_aresetn1] [get_bd_pins microblaze_0_axi_periph/M05_ARESETN] \
  [get_bd_pins microblaze_0_axi_periph/M06_ARESETN]
connect_bd_net [get_bd_pins processing_system7_0/FCLK_RESET0_N] [get_bd_pins rst_clk_wiz_1_100M_1/ext_reset_in]
set_property HDL_ATTRIBUTE.BMM_INFO_PROCESSOR {microblaze-le > main_design microblaze_0_local_memory/dlmb_bram_if_cntlr} [get_bd_cells microblaze_0]
set_property HDL_ATTRIBUTE.KEEP_HIERARCHY yes [get_bd_cells microblaze_0]

# ---- address map ----
assign_bd_address -offset 0x00000000 -range 128K -target_address_space [get_bd_addr_spaces microblaze_0/Data] [get_bd_addr_segs microblaze_0_local_memory/dlmb_bram_if_cntlr/SLMB/Mem]
assign_bd_address -offset 0x40000000 -range 4K -target_address_space [get_bd_addr_spaces microblaze_0/Data] [get_bd_addr_segs axi_gpio_0/S_AXI/Reg]
assign_bd_address -offset 0x40600000 -range 4K -target_address_space [get_bd_addr_spaces microblaze_0/Data] [get_bd_addr_segs axi_uartlite_0/S_AXI/Reg]
assign_bd_address -offset 0x41200000 -range 4K -target_address_space [get_bd_addr_spaces microblaze_0/Data] [get_bd_addr_segs microblaze_0_axi_intc/S_AXI/Reg]
assign_bd_address -offset 0x44A00000 -range 4K -target_address_space [get_bd_addr_spaces microblaze_0/Data] [get_bd_addr_segs axi_quad_spi_0/aximm/MEM0]
assign_bd_address -offset 0x44A10000 -range 4K -target_address_space [get_bd_addr_spaces microblaze_0/Data] [get_bd_addr_segs Calcul_Moyenne/myip_S4e_4reg_0/S00_AXI/S00_AXI_reg]
assign_bd_address -offset 0x44A20000 -range 64K -target_address_space [get_bd_addr_spaces microblaze_0/Data] [get_bd_addr_segs Calcul_Moyenne/myip_S4e_4reg_1/S00_AXI/S00_AXI_reg]
assign_bd_address -offset 0x44A30000 -range 64K -target_address_space [get_bd_addr_spaces microblaze_0/Data] [get_bd_addr_segs Calcul_Moyenne/myip_S4e_4reg_2/S00_AXI/S00_AXI_reg]
assign_bd_address -offset 0x00000000 -range 128K -target_address_space [get_bd_addr_spaces microblaze_0/Instruction] [get_bd_addr_segs microblaze_0_local_memory/ilmb_bram_if_cntlr/SLMB/Mem]

validate_bd_design
save_bd_design
